# EAGLE design voltage-sensor (EAGLE 7.0.0)
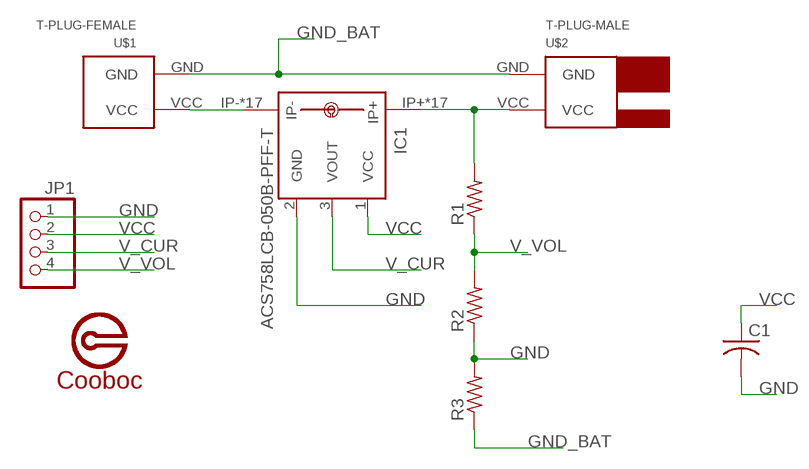
[diagram p0: schematic, sheet 1]

## Parts
C1  C-USC0805K  [C0805K]
IC1  ACS758LCB-050B-PFF-T  [CB-PFF]
JP1  PINHD-1X4  [1X04]
R1  R-US_M0805  [M0805]
R2  R-US_M0805  [M0805]
R3  R-US_0207/10  [0207/10]
U$1  T-PLUG-FEMALE  [T-FEMALE]
U$2  T-PLUG-MALE  [T-MALE]
U$3  COOBOC  [COOBOC]

## Nets
GND: C1.2 IC1.2(GND) JP1.1 R2.1 R3.2
GND_BAT: R3.1 U$1.GND U$2.GND
N$1: IC1.IP- IC1.IP-@2(IP-) IC1.IP-@3(IP-) IC1.IP-@4(IP-) IC1.IP-@5(IP-) IC1.IP-@6(IP-) IC1.IP-@7(IP-) IC1.IP-@8(IP-) IC1.IP-@9(IP-) IC1.IP-@10(IP-) IC1.IP-@11(IP-) IC1.IP-@12(IP-) IC1.IP-@13(IP-) IC1.IP-@14(IP-) IC1.IP-@15(IP-) IC1.IP-@16(IP-) IC1.IP-@17(IP-) U$1.VCC
V_CUR: IC1.3(VOUT) JP1.3
V_VOL: JP1.4 R1.1 R2.2
VBAT: IC1.IP+ IC1.IP+@2(IP+) IC1.IP+@3(IP+) IC1.IP+@4(IP+) IC1.IP+@5(IP+) IC1.IP+@6(IP+) IC1.IP+@7(IP+) IC1.IP+@8(IP+) IC1.IP+@9(IP+) IC1.IP+@10(IP+) IC1.IP+@11(IP+) IC1.IP+@12(IP+) IC1.IP+@13(IP+) IC1.IP+@14(IP+) IC1.IP+@15(IP+) IC1.IP+@16(IP+) IC1.IP+@17(IP+) R1.2 U$2.VCC
VCC: C1.1 IC1.1(VCC) JP1.2

## Library data of the parts
C1 = rcl:C-US: CAPACITOR, American symbol
IC1 = allegro:ACS758*: Thermally Enhanced, Fully Integrated, Hall Effect-Based Linear Current Sensor with 100 micro Ohm Current Conductor display layer 49 Reference in BRD and place VIAs on circles Source: http://www.allegromicro.com/en/Products/Part_Numbers/0758/0758.pdf; MPN: ACS758LCB-050B-PFF-T; OC_FARNELL: 1718997; OC_NEWARK: 04R7131
JP1 = pinhead:PINHD-1X4: PIN HEADER
R1-R3 = resistor:R-US_: RESISTOR, American symbol
U$1 = connector:T-PLUG-FEMALE
U$2 = connector:T-PLUG-MALE
U$3 = hqc-logo:COOBOC

## Board
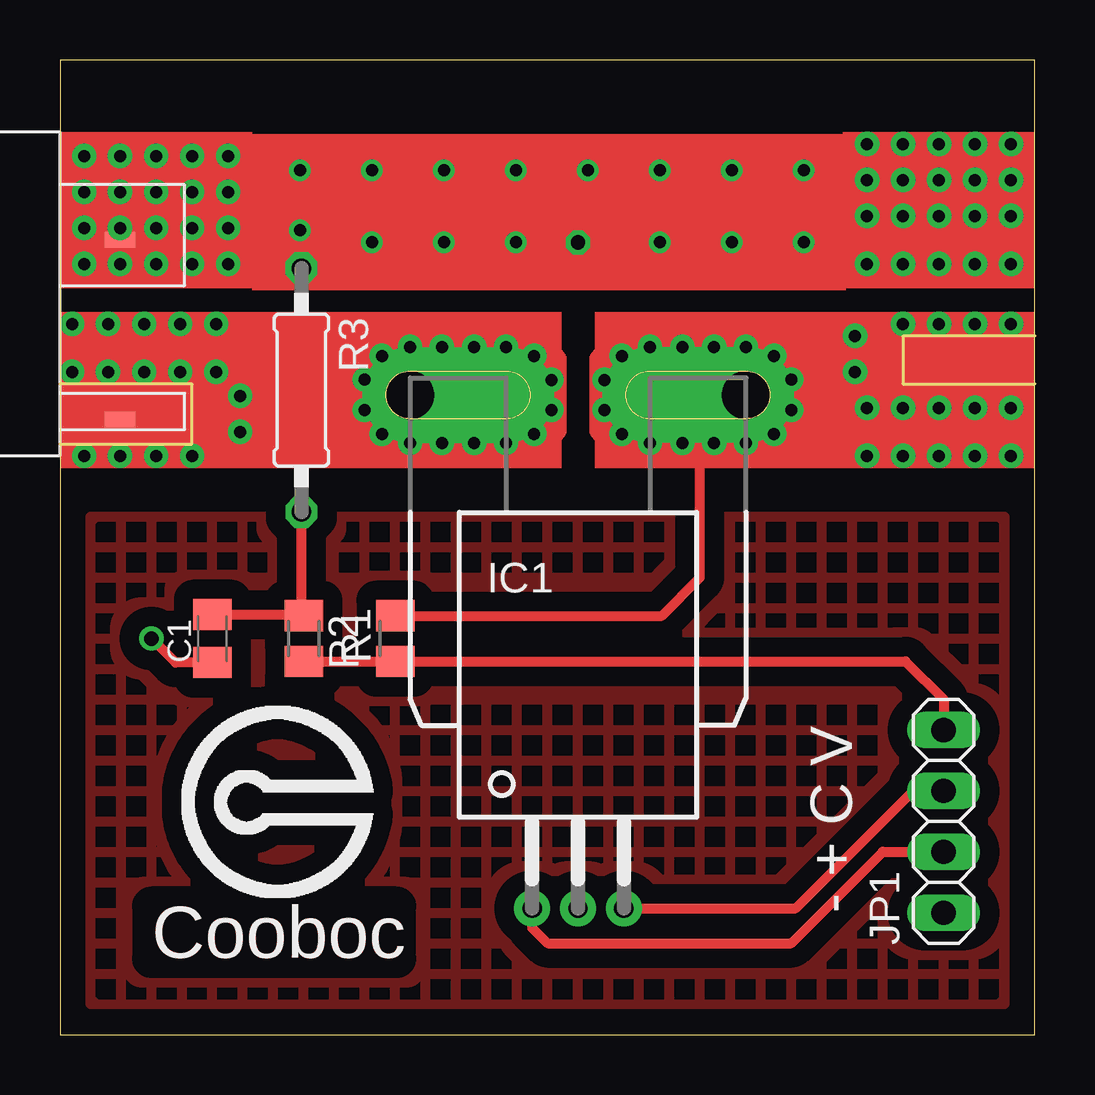
[diagram p1: board, top side]
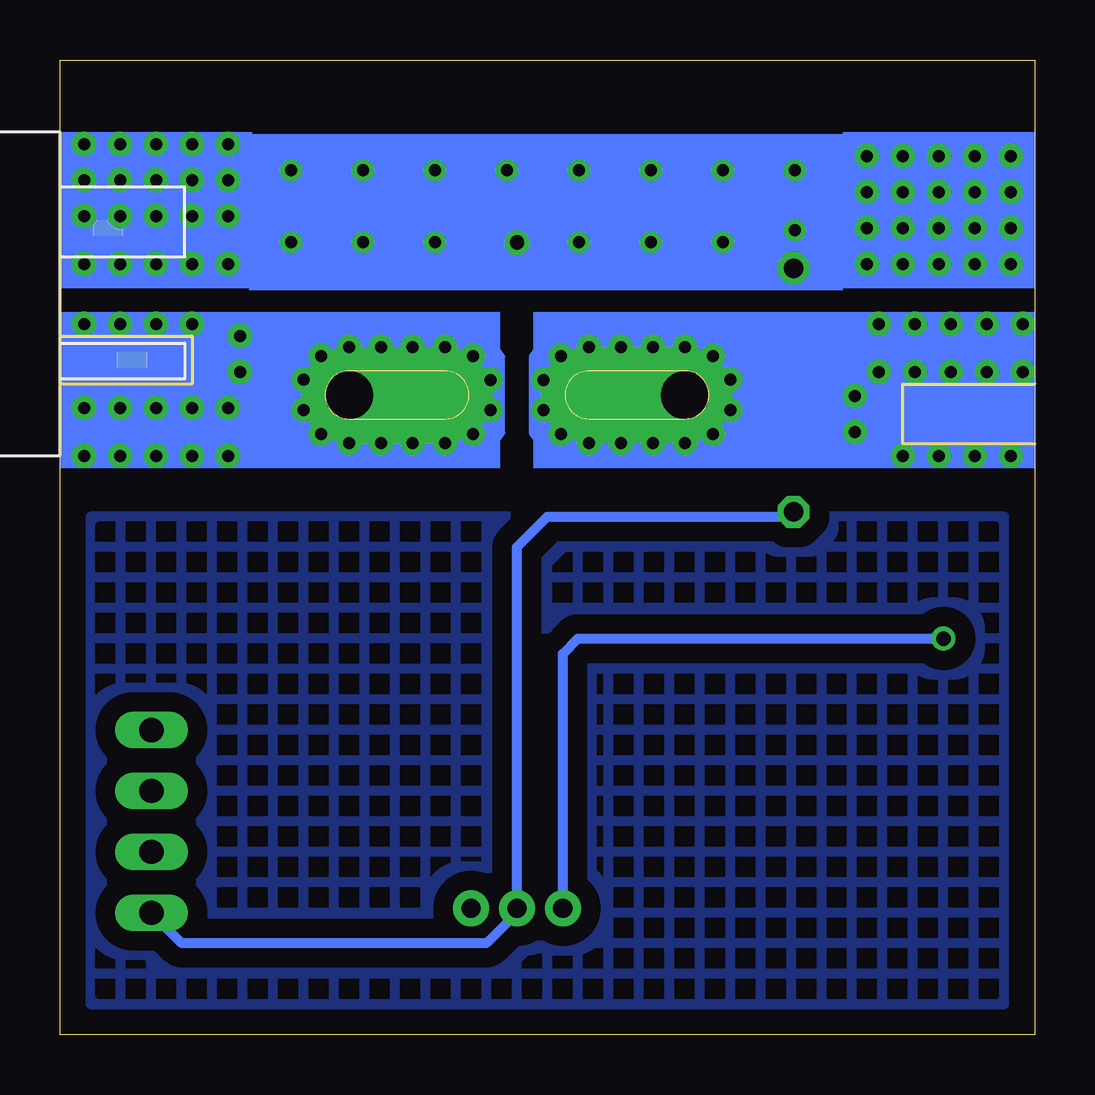
[diagram p2: board, bottom side, seen from below]

Size 40.64 x 40.63 mm. Coordinates in mm from the lower left corner, seen from the top.
Outline: 0,0 40.64,0 40.64,40.63 0,40.63 0,0
Copper layers (1*16): Top 0.035mm / dielectric 1.5mm / Bottom 0.035mm
Design rules "default": minimum track width 10mil, minimum drill 24mil, track to track 8mil, track to pad 8mil, pad to pad 8mil, via to via 8mil, smd to smd 8mil, copper to edge 40mil, drill to drill 8mil, minimum pad ring 10mil, minimum via ring 8mil, stop-mask expansion 4mil, vias tented up to drill 0mil, thermal gap 10mil

### Footprints (pad centres in the part's own frame; a part is rotated, then mirrored left to right if it is on the bottom)
C0805K = smd 1.3 x 1.6: 1 -1,0; 2 1,0
CB-PFF = drill 0.8 pad 1.5: 1 -1.91,-21.4; 2 0,-21.4; 3 1.91,-21.4 | drill 2 pad 4 offset: IP+ 7,0; IP- -7,0 | drill 0.5 pad 0.9: IP+@2 8.89,0.635; IP+@3 8.89,-0.635; IP+@4 8.175,-1.625; IP+@5 7,-2; IP+@6 5.675,-2; IP+@7 4.35,-2; IP+@8 3,-2; IP+@9 1.825,-1.625; IP+@10 1.1,-0.625; IP+@11 1.1,0.625; IP+@12 1.825,1.625; IP+@13 3,2; IP+@14 4.35,2; IP+@15 5.675,2; IP+@16 7,2; IP+@17 8.175,1.625; IP-@2 -8.89,0.635; IP-@3 -8.89,-0.635; IP-@4 -8.175,-1.625; IP-@5 -7,-2; IP-@6 -5.675,-2; IP-@7 -4.325,-2; IP-@8 -3,-2; IP-@9 -1.825,-1.625; IP-@10 -1.1,-0.625; IP-@11 -1.1,0.625; IP-@12 -1.825,1.625; IP-@13 -3,2; IP-@14 -4.325,2; IP-@15 -5.675,2; IP-@16 -7,2; IP-@17 -8.175,1.625
1X04 = drill 1.016 long: 1 -3.81,0; 2 -1.27,0; 3 1.27,0; 4 3.81,0
M0805 = smd 1.3 x 1.6: 1 -0.95,0; 2 0.95,0
0207/10 = drill 0.813 octagon: 1 -5.08,0; 2 5.08,0
T-FEMALE = smd 1.27 x 0.635: GND 2.5,9; VCC 2.5,1.5 | drill 0.5 pad 0.61: P$1 0.5,5.5; P$2 2,5.5; P$3 3.5,5.5; P$4 5,5.5; P$5 6.5,5.5; P$10 1,8; P$11 0.5,3.5; P$12 2,3.5; P$13 3.5,3.5; P$14 5,3.5; P$15 6.5,3.5; P$16 7.5,2.5; P$18 7.5,1; P$20 1,0; P$21 2.5,0; P$22 4,0; P$23 5.5,0; P$24 2.5,8; P$25 4,8; P$26 5.5,8; P$27 7,8; P$28 7,9.5; P$29 5.5,9.5; P$30 4,9.5; P$31 2.5,9.5; P$32 1,9.5; P$33 1,11; P$34 2.5,11; P$35 4,11; P$36 5.5,11; P$37 7,11; P$38 7,12.5; P$39 5.5,12.5; P$40 4,12.5; P$41 2.5,12.5; P$42 1,12.5
T-MALE = smd 1.27 x 0.635: GND 2,9.5; VCC 3,4 | drill 0.5 pad 0.61: P$2 1,11.5; P$3 1,10; P$4 1,8; P$5 2.5,8; P$6 2.5,10; P$7 2.5,11.5; P$10 4,11.5; P$11 4,10; P$12 4,8; P$13 5.5,8; P$14 5.5,10; P$15 5.5,11.5; P$18 7,11.5; P$19 7,10; P$20 7,8; P$21 1,5.5; P$22 2.5,5.5; P$23 4,5.5; P$24 5.5,5.5; P$26 1,2; P$27 5.5,2; P$33 1,0; P$34 7,0; P$35 2.5,0; P$36 4,0; P$37 7,2; P$38 5.5,0; P$39 1,13; P$40 2.5,13; P$41 4,13; P$42 5.5,13; P$43 7,13; P$44 2.5,2; P$45 4,2; P$47 7.5,3.5; P$49 7.5,5

### Placement (x,y rotation side)
C1  6.35,16.51 90 top
IC1  21.59,26.67 0 top
JP1  36.83,8.89 90 top
R1  13.97,16.51 90 top
R2  10.16,16.51 270 top
R3  10.06,26.87 270 top
U$1  0,24.13 0 top
U$2  40.64,24.13 0 bottom
U$3  8.89,7.62 0 top

### Tracks (layer width: path | path; a pad name or v marks a point on that pad's centre or on a via)
GND
  Top 0.406: C1.2 10.16,17.51 R2.1 10.06,17.46 R3.2
  Bottom 0.406: JP1.1 35.56,3.81 22.86,3.81 21.59,5.08 IC1.2 21.59,20.32 20.32,21.59 10.26,21.59 R3.2
GND_BAT  (via drill 0.6)
  Top 0.406: U$1.GND 10.16,33.13 | 10.16,33.13 21.59,33.13 v21.59,33.02 | R3.1 10.16,33.13
  Bottom 0.406: v21.59,33.02 35.49,33.02 U$2.GND
N$1
  Top 0.406: U$1.VCC 11.61,25.63 IC1.IP-@15
N$2  (via drill 0.5)
  other vias: 10,36.03
N$3  (via drill 0.5)
  other vias: 13,36.03
N$4  (via drill 0.5)
  other vias: 16,36.03
N$5  (via drill 0.5)
  other vias: 19,36.03
N$6  (via drill 0.5)
  other vias: 22,36.03
N$7  (via drill 0.5)
  other vias: 25,36.03
N$8  (via drill 0.5)
  other vias: 28,36.03
N$9  (via drill 0.5)
  other vias: 31,36.03
N$10  (via drill 0.5)
  other vias: 31,33.03
N$11  (via drill 0.5)
  other vias: 28,33.03
N$12  (via drill 0.5)
  other vias: 25,33.03
N$13  (via drill 0.5)
  other vias: 19,33.03
N$14  (via drill 0.5)
  other vias: 16,33.03
N$15  (via drill 0.5)
  other vias: 13,33.03
N$16  (via drill 0.5)
  other vias: 10,33.53
N$17
  pour Top (isolate 0.813, hatched): 1.27,21.59 39.37,21.59 39.37,1.27 1.27,1.27
N$18
  pour Bottom (isolate 0.813, hatched): 1.27,21.59 39.37,21.59 39.37,1.27 1.27,1.27
V_CUR
  Top 0.406: IC1.3 30.67,5.27 35.56,10.16 JP1.3
V_VOL
  Top 0.406: R2.2 R1.1 35.24,15.56 36.83,13.97 JP1.4
VBAT
  Top 0.406: R1.2 25.08,17.46 26.67,19.05 26.67,24.75 IC1.IP+
  Bottom 0.406: IC1.IP+@2 36.81,27.3 U$2.VCC
VCC  (via drill 0.6)
  Top 0.406: IC1.1 19.68,4.45 20.32,3.81 30.48,3.81 34.29,7.62 JP1.2 | C1.1 4.81,15.51 v3.81,16.51
  Bottom 0.406: IC1.1 19.68,15.88 19.05,16.51 v3.81,16.51
(copper drawn outside any net)
  shapes: Bottom area x3, Top area x3

### Text on the board
tNames: - + C V